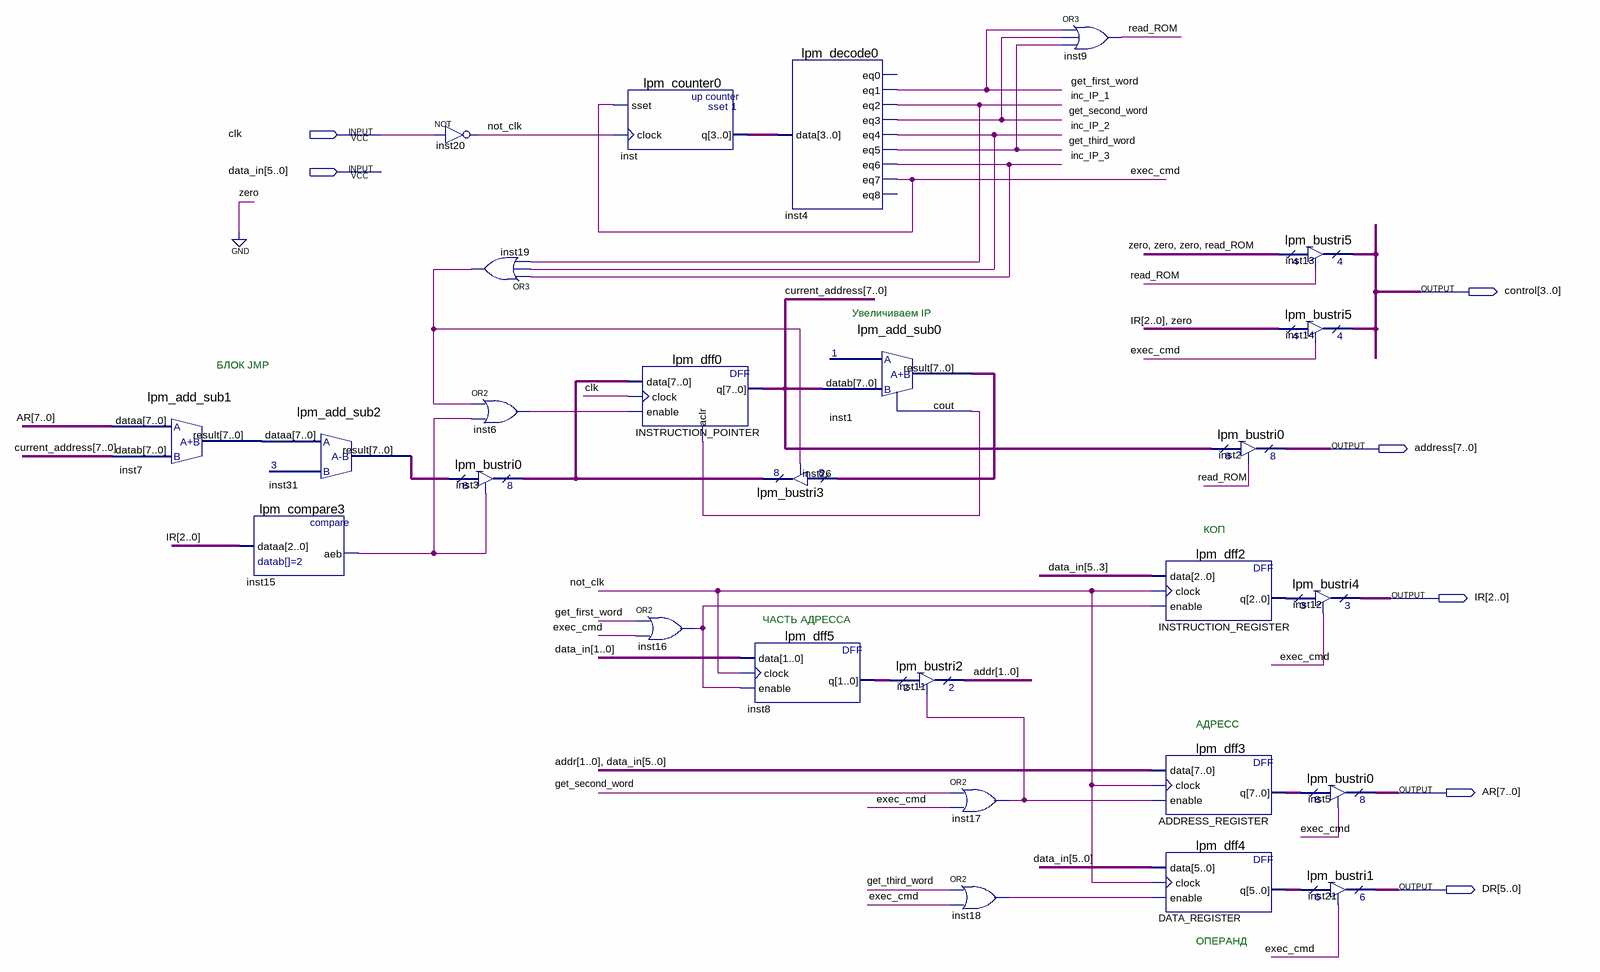
[diagram p0: schematic sheet]
// Quartus schematic control_block.bdf as structural Verilog: 27 symbols, 7 pins
module control_block (
  input  clk,
  input  [5:0] data_in,
  output [3:0] control,
  output [7:0] address,
  output [2:0] IR,
  output [7:0] AR,
  output [5:0] DR
);

  wire exec_cmd, get_first_word, get_second_word, get_third_word, inc_IP_1, inc_IP_2, inc_IP_3, inst1_cout,
       inst6_out, inst15_aeb, inst16_out, inst17_out, inst18_out, inst19_out, not_clk, read_ROM;
  wire [1:0] addr, inst8_q;
  wire [2:0] INSTRUCTION_REGISTER_q;
  wire [3:0] inst_q;
  wire [5:0] DATA_REGISTER_q;
  wire [7:0] ADDRESS_REGISTER_q, current_address, inst1_result, inst3_tridata, inst7_result, inst31_result;

  lpm_add_sub1 inst7 (.dataa(AR), .datab(current_address), .result(inst7_result));
  lpm_add_sub2 inst31 (.dataa(inst7_result), .result(inst31_result));
  lpm_compare3 inst15 (.dataa(IR), .aeb(inst15_aeb));
  not inst20 (not_clk, clk);
  lpm_bustri0 inst3 (.enabledt(inst15_aeb), .data(inst31_result), .tridata(inst3_tridata));
  or inst19 (inst19_out, inc_IP_3, inc_IP_2, inc_IP_1);
  or inst6 (inst6_out, inst19_out, inst15_aeb);
  lpm_counter0 inst (.sset(exec_cmd), .clock(not_clk), .q(inst_q));
  lpm_dff0 INSTRUCTION_POINTER (
    .data(inst3_tridata), .clock(clk), .enable(inst6_out), .aclr(inst1_cout), .q(current_address));
  or inst16 (inst16_out, get_first_word, exec_cmd);
  lpm_bustri3 inst26 (.enabledt(inst19_out), .data(inst1_result), .tridata(inst3_tridata));
  lpm_dff5 inst8 (.data(data_in[1:0]), .clock(not_clk), .enable(inst16_out), .q(inst8_q));
  lpm_decode0 inst4 (
    .data(inst_q), .eq1(get_first_word), .eq2(inc_IP_1), .eq3(get_second_word), .eq4(inc_IP_2),
    .eq5(get_third_word), .eq6(inc_IP_3), .eq7(exec_cmd));  // open: eq0, eq8
  lpm_add_sub0 inst1 (.datab(current_address), .result(inst1_result), .cout(inst1_cout));
  lpm_bustri2 inst11 (.enabledt(inst17_out), .data(inst8_q), .tridata(addr));
  or inst17 (inst17_out, get_second_word, exec_cmd);
  or inst18 (inst18_out, get_third_word, exec_cmd);
  or inst9 (read_ROM, get_first_word, get_second_word, get_third_word);
  lpm_dff2 INSTRUCTION_REGISTER (.data(data_in[5:3]), .clock(not_clk), .enable(inst16_out), .q(INSTRUCTION_REGISTER_q));
  lpm_dff3 ADDRESS_REGISTER (.data({addr, data_in}), .clock(not_clk), .enable(inst17_out), .q(ADDRESS_REGISTER_q));
  lpm_dff4 DATA_REGISTER (.data(data_in), .clock(not_clk), .enable(inst18_out), .q(DATA_REGISTER_q));
  lpm_bustri0 inst2 (.enabledt(read_ROM), .data(current_address), .tridata(address));
  lpm_bustri5 inst13 (.enabledt(read_ROM), .data({3'b000, read_ROM}), .tridata(control));
  lpm_bustri5 inst14 (.enabledt(exec_cmd), .data({IR, 1'b0}), .tridata(control));
  lpm_bustri4 inst12 (.enabledt(exec_cmd), .data(INSTRUCTION_REGISTER_q), .tridata(IR));
  lpm_bustri0 inst5 (.enabledt(exec_cmd), .data(ADDRESS_REGISTER_q), .tridata(AR));
  lpm_bustri1 inst21 (.enabledt(exec_cmd), .data(DATA_REGISTER_q), .tridata(DR));

  // Notes on the sheet:
  //   Увеличиваем IP
  //   БЛОК JMP
  //   КОП
  //   ЧАСТЬ АДРЕССА
  //   АДРЕСС
  //   ОПЕРАНД
endmodule
